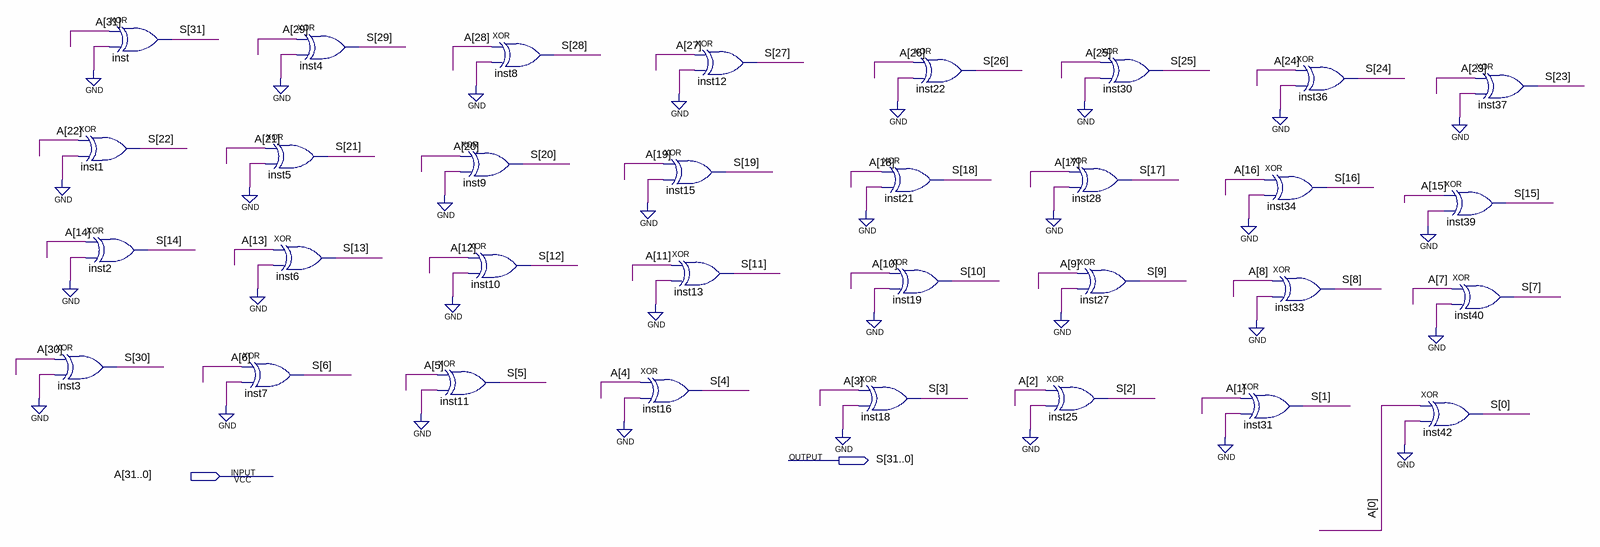
[diagram p0: schematic sheet]
// Quartus schematic testing_xor.bdf as structural Verilog: 32 symbols, 2 pins
module testing_xor (
  input  [31:0] A,
  output [31:0] S
);

  xor inst3 (S[30], A[30], 1'b0);
  xor inst (S[31], A[31], 1'b0);
  xor inst1 (S[22], A[22], 1'b0);
  xor inst2 (S[14], A[14], 1'b0);
  xor inst7 (S[6], A[6], 1'b0);
  xor inst4 (S[29], A[29], 1'b0);
  xor inst5 (S[21], A[21], 1'b0);
  xor inst6 (S[13], A[13], 1'b0);
  xor inst8 (S[28], A[28], 1'b0);
  xor inst9 (S[20], A[20], 1'b0);
  xor inst10 (S[12], A[12], 1'b0);
  xor inst11 (S[5], A[5], 1'b0);
  xor inst15 (S[19], A[19], 1'b0);
  xor inst13 (S[11], A[11], 1'b0);
  xor inst16 (S[4], A[4], 1'b0);
  xor inst12 (S[27], A[27], 1'b0);
  xor inst18 (S[3], A[3], 1'b0);
  xor inst22 (S[26], A[26], 1'b0);
  xor inst21 (S[18], A[18], 1'b0);
  xor inst19 (S[10], A[10], 1'b0);
  xor inst25 (S[2], A[2], 1'b0);
  xor inst30 (S[25], A[25], 1'b0);
  xor inst28 (S[17], A[17], 1'b0);
  xor inst27 (S[9], A[9], 1'b0);
  xor inst31 (S[1], A[1], 1'b0);
  xor inst36 (S[24], A[24], 1'b0);
  xor inst34 (S[16], A[16], 1'b0);
  xor inst33 (S[8], A[8], 1'b0);
  xor inst42 (S[0], A[0], 1'b0);
  xor inst37 (S[23], A[23], 1'b0);
  xor inst39 (S[15], A[15], 1'b0);
  xor inst40 (S[7], A[7], 1'b0);
endmodule
